# Altium schematic sheet Sedra.SchDoc
size A4
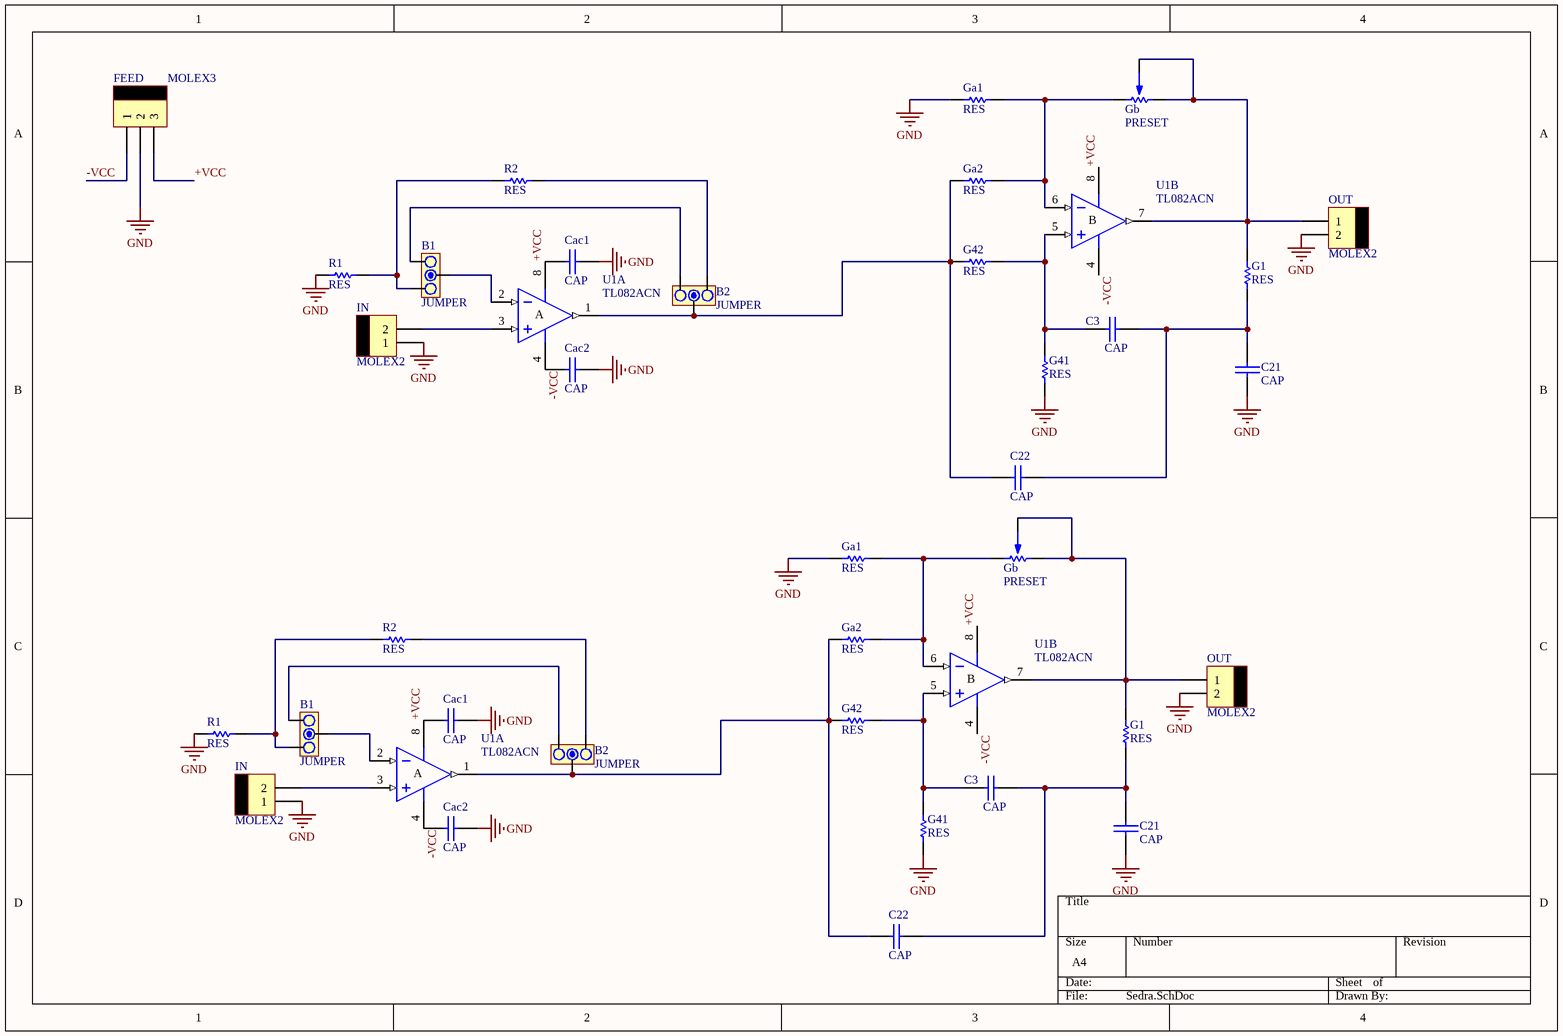
[diagram p0: Sedra.SchDoc]

## Parts
(Parts that share a designator on the sheet are numbered #1, #2 ... from top to bottom, then left to right.)
B1#1  JUMPER  [JUMPER3]
B1#2  JUMPER  [JUMPER3]
B2#1  JUMPER  [JUMPER3]
B2#2  JUMPER  [JUMPER3]
C3#1  CAP  [CAP200]
C3#2  CAP  [CAP200]
C21#1  CAP  [CAP200]
C21#2  CAP  [CAP200]
C22#1  CAP  [CAP200]
C22#2  CAP  [CAP200]
Cac1#1  CAP  [CAP200]
Cac1#2  CAP  [CAP200]
Cac2#1  CAP  [CAP200]
Cac2#2  CAP  [CAP200]
FEED  MOLEX3  [MOLEX3]
G1#1  RES  [0805]
G1#2  RES  [0805]
G41#1  RES  [0805]
G41#2  RES  [0805]
G42#1  RES  [0805]
G42#2  RES  [0805]
Ga1#1  RES  [0805]
Ga1#2  RES  [0805]
Ga2#1  RES  [0805]
Ga2#2  RES  [0805]
Gb#1  PRESET  [PRESET V]
Gb#2  PRESET  [PRESET V]
IN#1  MOLEX2  [MOLEX2]
IN#2  MOLEX2  [MOLEX2]
OUT#1  MOLEX2  [MOLEX2]
OUT#2  MOLEX2  [MOLEX2]
R1#1  RES  [0805]
R1#2  RES  [0805]
R2#1  RES  [0805]
R2#2  RES  [0805]
U1#1  TL082ACN  [DIP8]  (parts A,B of 2)
U1#2  TL082ACN  [DIP8]  (parts A,B of 2)

## Nets
GND: C21#1.2 C21#2.2 Cac1#1.2 Cac1#2.2 Cac2#1.2 Cac2#2.2 FEED.2 G41#1.1 G41#2.1 Ga1#1.1 Ga1#2.1 IN#1.1 IN#2.1 OUT#1.2 OUT#2.2 R1#1.1 R1#2.1
+VCC: Cac1#1.1 Cac1#2.1 FEED.3 U1#1.8(V+) U1#2.8(V+)
-VCC: Cac2#1.1 Cac2#2.1 FEED.1 U1#1.4(V-) U1#2.4(V-)
NetB1#1_1: B1#1.1 R1#1.2 R2#1.1
NetB1#1_2: B1#1.2 U1#1.2(IN-)
NetB1#1_3: B1#1.3 B2#1.1
NetB1#2_1: B1#2.1 R1#2.2 R2#2.1
NetB1#2_2: B1#2.2 U1#2.2(IN-)
NetB1#2_3: B1#2.3 B2#2.1
NetB2#1_2: B2#1.2 C22#1.1 G42#1.1 Ga2#1.1 U1#1.1(OUT)
NetB2#1_3: B2#1.3 R2#1.2
NetB2#2_2: B2#2.2 C22#2.1 G42#2.1 Ga2#2.1 U1#2.1(OUT)
NetB2#2_3: B2#2.3 R2#2.2
NetC3#1_1: C3#1.1 G41#1.2 G42#1.2 U1#1.5(IN+)
NetC3#1_2: C3#1.2 C21#1.1 C22#1.2 G1#1.1
NetC3#2_1: C3#2.1 G41#2.2 G42#2.2 U1#2.5(IN+)
NetC3#2_2: C3#2.2 C21#2.1 C22#2.2 G1#2.1
NetG1#1_2: G1#1.2 Gb#1.2 Gb#1.3 OUT#1.1 U1#1.7(OUT)
NetG1#2_2: G1#2.2 Gb#2.2 Gb#2.3 OUT#2.1 U1#2.7(OUT)
NetGa1#1_2: Ga1#1.2 Ga2#1.2 Gb#1.1 U1#1.6(IN-)
NetGa1#2_2: Ga1#2.2 Ga2#2.2 Gb#2.1 U1#2.6(IN-)
NetIN#1_2: IN#1.2 U1#1.3(IN+)
NetIN#2_2: IN#2.2 U1#2.3(IN+)

## Notes on the sheet
- (in symbol TL082ACN, part A) A
- (in symbol TL082ACN, part B) B

## Library data of the parts
B1#1 B1#2 B2#1 B2#2 = JUMPER3
U1#1 U1#2 = TL082ACN: General-Purpose J-FET Dual Operational Amplifier; Published: 24-Aug-2001; LatestRevisionDate: 06-Jun-2005; LatestRevisionNote: Stylized 3D Model Added.; DatasheetVersion: Jan-1999; PackageReference: DIP8; Publisher: Altium Limited; PackageDescription: DIP; 8 Leads; Row Spacing 7.62 mm; Pitch 2.54 mm; Code_JEDEC: MO-001-AN; ComponentLink1Description: Manufacturer Link; ComponentLink1URL: http://www.st.com/; ComponentLink2Description: Datasheet; ComponentLink2URL: http://www.st.com/stonline/products/literature/ds/2300/tl082.pdf